# Altium project marvin.PrjPCB
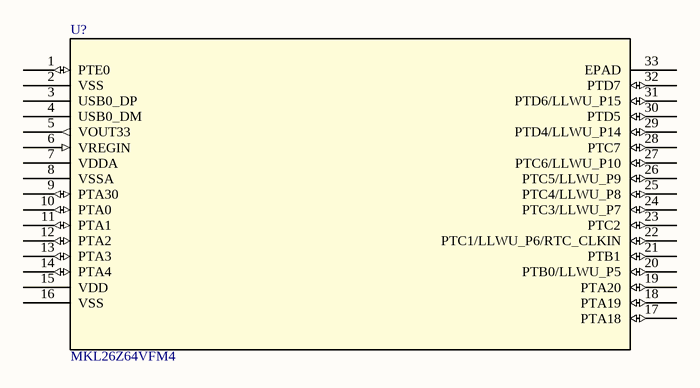
[diagram p0: programmer.SchDoc]
2 sheets, 11 parts. Net scope: flat (ports and power ports of the same name join across sheets).
Sheets:
  programmer.SchDoc
  power_control.SchDoc

## Sheet programmer.SchDoc
size A4

### Parts
U?  MKL26Z64VFM4  [QFN-32_5X5X0.9]

### Nets

Not connected (* = marked no-connect by the designer): U? 1(PTE0) 2(VSS) 3(USB0_DP) 4(USB0_DM) 5(VOUT33) 6(VREGIN) 7(VDDA) 8(VSSA) 9(PTA30) 10(PTA0) 11(PTA1) 12(PTA2) 13(PTA3) 14(PTA4) 15(VDD) 16(VSS) 17(PTA18) 18(PTA19) 19(PTA20) 20(PTB0/LLWU_P5) 21(PTB1) 22(PTC1/LLWU_P6/RTC_CLKIN) 23(PTC2) 24(PTC3/LLWU_P7) 25(PTC4/LLWU_P8) 26(PTC5/LLWU_P9) 27(PTC6/LLWU_P10) 28(PTC7) 29(PTD4/LLWU_P14) 30(PTD5) 31(PTD6/LLWU_P15) 32(PTD7) 33(EPAD)

### Library data of the parts
U? = MKL26Z64VFM4: Imported; Vendor: FREESCALE; CPU: ARM Cortex-M0+; Max_Frequency: 48; Flash_KB: 64; SRAM_KB: 8; Pin_Count: 32; Manufacturer_Part_Number: mkl26z64vfm4; Package: QFN; RefDes: RefDes; Type: Type; Value: Value

## Sheet power_control.SchDoc: Power Management
size A4; DrawnBy: Otávio Borges; Revision: 0.6; ProjectName: Marvin
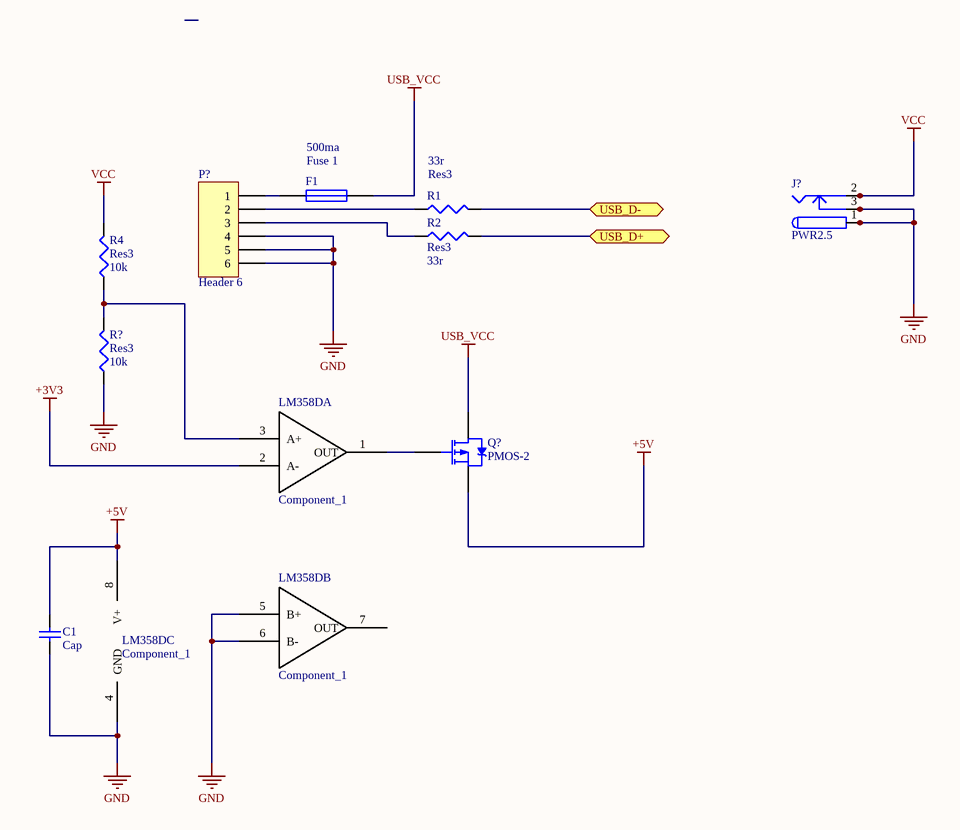
[diagram p1: power_control.SchDoc]

### Parts
C1  Cap  [RAD-0.3]
F1  Fuse 1  CURRENT: 500ma  [1812]
J?  PWR2.5  [Model Name]
LM358D  Component_1  [Micro8]  (parts A,B,C of 3)
P?  Header 6  [USB2.5-2H4D]
Q?  PMOS-2  [TO-220AB]
R1  Res3  value 33r  [6-0805_M]
R2  Res3  value 33r  [6-0805_M]
R4  Res3  value 10k  [6-0805_M]
R?  Res3  value 10k  [6-0805_M]

### Ports
USB_D+ (bidir), USB_D- (bidir)

### Nets
+3V3: LM358D.2(A-)
+5V: C1.2 LM358D.8(V+) Q?.3(S)
GND: C1.1 J?.1 J?.1A J?.1B J?.3 J?.3A J?.3B LM358D.4(GND) LM358D.5(B+) LM358D.6(B-) P?.4 P?.5 P?.6 R?.1
USB_VCC: F1.2 Q?.2(D)
VCC: J?.2 J?.2A J?.2B R4.2
NetF1_1: F1.1 P?.1
NetLM358D_1: LM358D.1(OUT) Q?.1(G)
NetLM358D_3: LM358D.3(A+) R4.1 R?.2
NetP?_2: P?.2 R1.1
NetP?_3: P?.3 R2.1
NetR1_2: R1.2 ; port USB_D-
NetR2_2: R2.2 ; port USB_D+

Not connected (* = marked no-connect by the designer): LM358D 7(OUT)

### Library data of the parts
C1 = Cap: Capacitor; Published: 8-Jun-2000; LatestRevisionDate: 17-Jul-2002; LatestRevisionNote: Re-released for DXP Platform.; PackageReference: RAD-0.3; Publisher: Altium Limited; PackageDescription: Radial Cap, Thru-Hole; 2 Leads; 0.3 in Pin Spacing
F1 = Fuse 1: Fuse; Published: 8-Jun-2000; LatestRevisionDate: 17-Jul-2002; LatestRevisionNote: Re-released for DXP Platform.; PackageReference: PIN-W2/E2.8; Publisher: Altium Limited; PackageDescription: Thru-Hole; 2 Leads
J? = PWR2.5: Low Voltage Power Supply Connector; Published: 17-Dec-2003; DatasheetDocument: 09-May-2002; Publisher: Altium Limited; ComponentLink1Description: Manufacturer Link; ComponentLink1URL: http://domino.kycon.com/internet/Products.html
P? = Header 6: Header, 6-Pin; LatestRevisionDate: 17-Jul-2002; LatestRevisionNote: Re-released for DXP Platform.; Publisher: Altium Limited
Q? = PMOS-2: P-Channel Power MOSFET; Note: Pin 4 not drawn and electrically connected to Pin 2.; Published: 8-Jun-2000; LatestRevisionDate: 17-Jul-2002; LatestRevisionNote: Re-released for DXP Platform.; DatasheetVersion: PD-9.390D; PackageVersion: Feb-1997; PackageReference: TO-220AB; Publisher: Altium Limited; PackageDescription: TO, Thru-Hole, Vertical, Heatsink Mounted; 3 In-Line Leads; Pitch 2.54 mm; ComponentLink1Description: Manufacturer Link; ComponentLink1URL: http://www.irf.com/
R1 R2 R4 R? = Res3: Resistor; Published: 8-Jun-2000; LatestRevisionDate: 29-May-2009; LatestRevisionNote: IPC-7351 Footprint Added.; PackageReference: J1-0603; Publisher: Altium Limited; PackageDescription: Chip Resistor